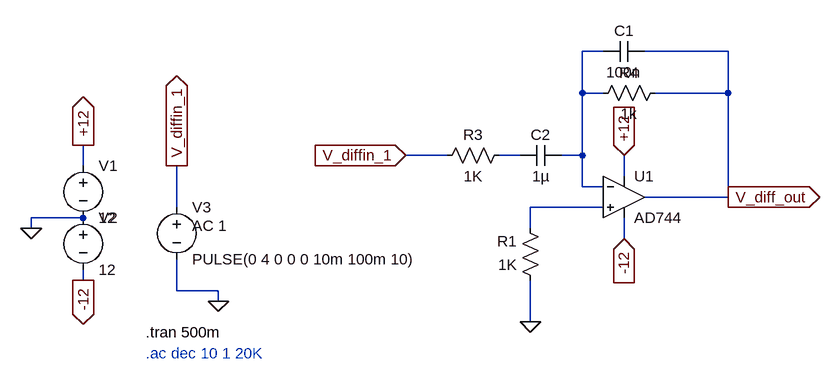
[diagram p0: schematic Differentiator.asc]
Differentiator.asc, the LTspice schematic file:
Version 4.1
SHEET 1 880 680
WIRE 112 -592 80 -592
WIRE 304 -592 176 -592
WIRE 80 -528 80 -592
WIRE 112 -528 80 -528
WIRE 304 -528 304 -592
WIRE 304 -528 192 -528
WIRE -128 -432 -192 -432
WIRE -16 -432 -48 -432
WIRE 80 -432 80 -528
WIRE 80 -432 48 -432
WIRE -688 -416 -688 -448
WIRE 144 -400 144 -432
WIRE 80 -384 80 -432
WIRE 112 -384 80 -384
WIRE 304 -368 304 -528
WIRE 304 -368 176 -368
WIRE -544 -352 -544 -416
WIRE 112 -352 0 -352
WIRE -688 -336 -768 -336
WIRE -768 -320 -768 -336
WIRE 0 -320 0 -352
WIRE 144 -304 144 -336
WIRE -688 -240 -688 -256
WIRE -544 -224 -544 -272
WIRE -480 -224 -544 -224
WIRE -480 -208 -480 -224
WIRE 0 -176 0 -240
FLAG 304 -368 V_diff_out
IOPIN 304 -368 Out
FLAG -768 -320 0
FLAG -480 -208 0
FLAG -544 -416 V_diffin_1
IOPIN -544 -416 Out
FLAG -688 -448 +12
IOPIN -688 -448 Out
FLAG 144 -432 +12
IOPIN 144 -432 In
FLAG -688 -240 -12
IOPIN -688 -240 Out
FLAG 144 -304 -12
IOPIN 144 -304 In
FLAG 0 -176 0
FLAG -192 -432 V_diffin_1
IOPIN -192 -432 In
SYMBOL OpAmps\\AD744 144 -432 R0
SYMATTR InstName U1
SYMBOL res 16 -224 R180
WINDOW 0 36 76 Left 2
WINDOW 3 36 40 Left 2
SYMATTR InstName R1
SYMATTR Value 1K
SYMATTR SpiceLine tol=1 pwr=0.1
SYMBOL res -32 -448 R90
WINDOW 0 0 56 VBottom 2
WINDOW 3 32 56 VTop 2
SYMATTR InstName R3
SYMATTR Value 1K
SYMATTR SpiceLine tol=1 pwr=0.1
SYMBOL res 208 -544 R90
WINDOW 0 0 56 VBottom 2
WINDOW 3 32 56 VTop 2
SYMATTR InstName R4
SYMATTR Value 1k
SYMATTR SpiceLine tol=1 pwr=0.1
SYMBOL voltage -688 -432 R0
WINDOW 123 0 0 Left 0
WINDOW 39 0 0 Left 0
SYMATTR InstName V1
SYMATTR Value 12
SYMBOL voltage -688 -352 R0
WINDOW 123 0 0 Left 0
WINDOW 39 0 0 Left 0
SYMATTR InstName V2
SYMATTR Value 12
SYMBOL voltage -544 -368 R0
WINDOW 123 24 44 Left 2
WINDOW 39 0 0 Left 0
SYMATTR Value2 AC 1
SYMATTR InstName V3
SYMATTR Value PULSE(0 4 0 0 0 10m 100m 10)
SYMBOL cap 48 -448 R90
WINDOW 0 0 32 VBottom 2
WINDOW 3 32 32 VTop 2
SYMATTR InstName C2
SYMATTR Value 1µ
SYMBOL cap 176 -608 R90
WINDOW 0 0 32 VBottom 2
WINDOW 3 32 32 VTop 2
SYMATTR InstName C1
SYMATTR Value 100n
TEXT -592 -160 Left 2 !.tran 500m
TEXT -592 -128 Left 2 ;.ac dec 10 1 20K

The netlist it stands for:
* Differentiator.asc
X§U1 N003 N001 +12 -12 V_diff_out AD744  ; pins In+ In- V+ V- OUT
R1 0 N003 1K tol=1 pwr=0.1
R3 N002 V_diffin_1 1K tol=1 pwr=0.1
R4 V_diff_out N001 1k tol=1 pwr=0.1
V1 +12 0 12
V2 0 -12 12
V3 V_diffin_1 0 PULSE(0 4 0 0 0 10m 100m 10) AC 1
C2 N001 N002 1µ
C1 V_diff_out N001 100n
.tran 500m
* .ac dec 10 1 20K
.backanno
.end